# EAGLE design Haptic (EAGLE 9.6.2)
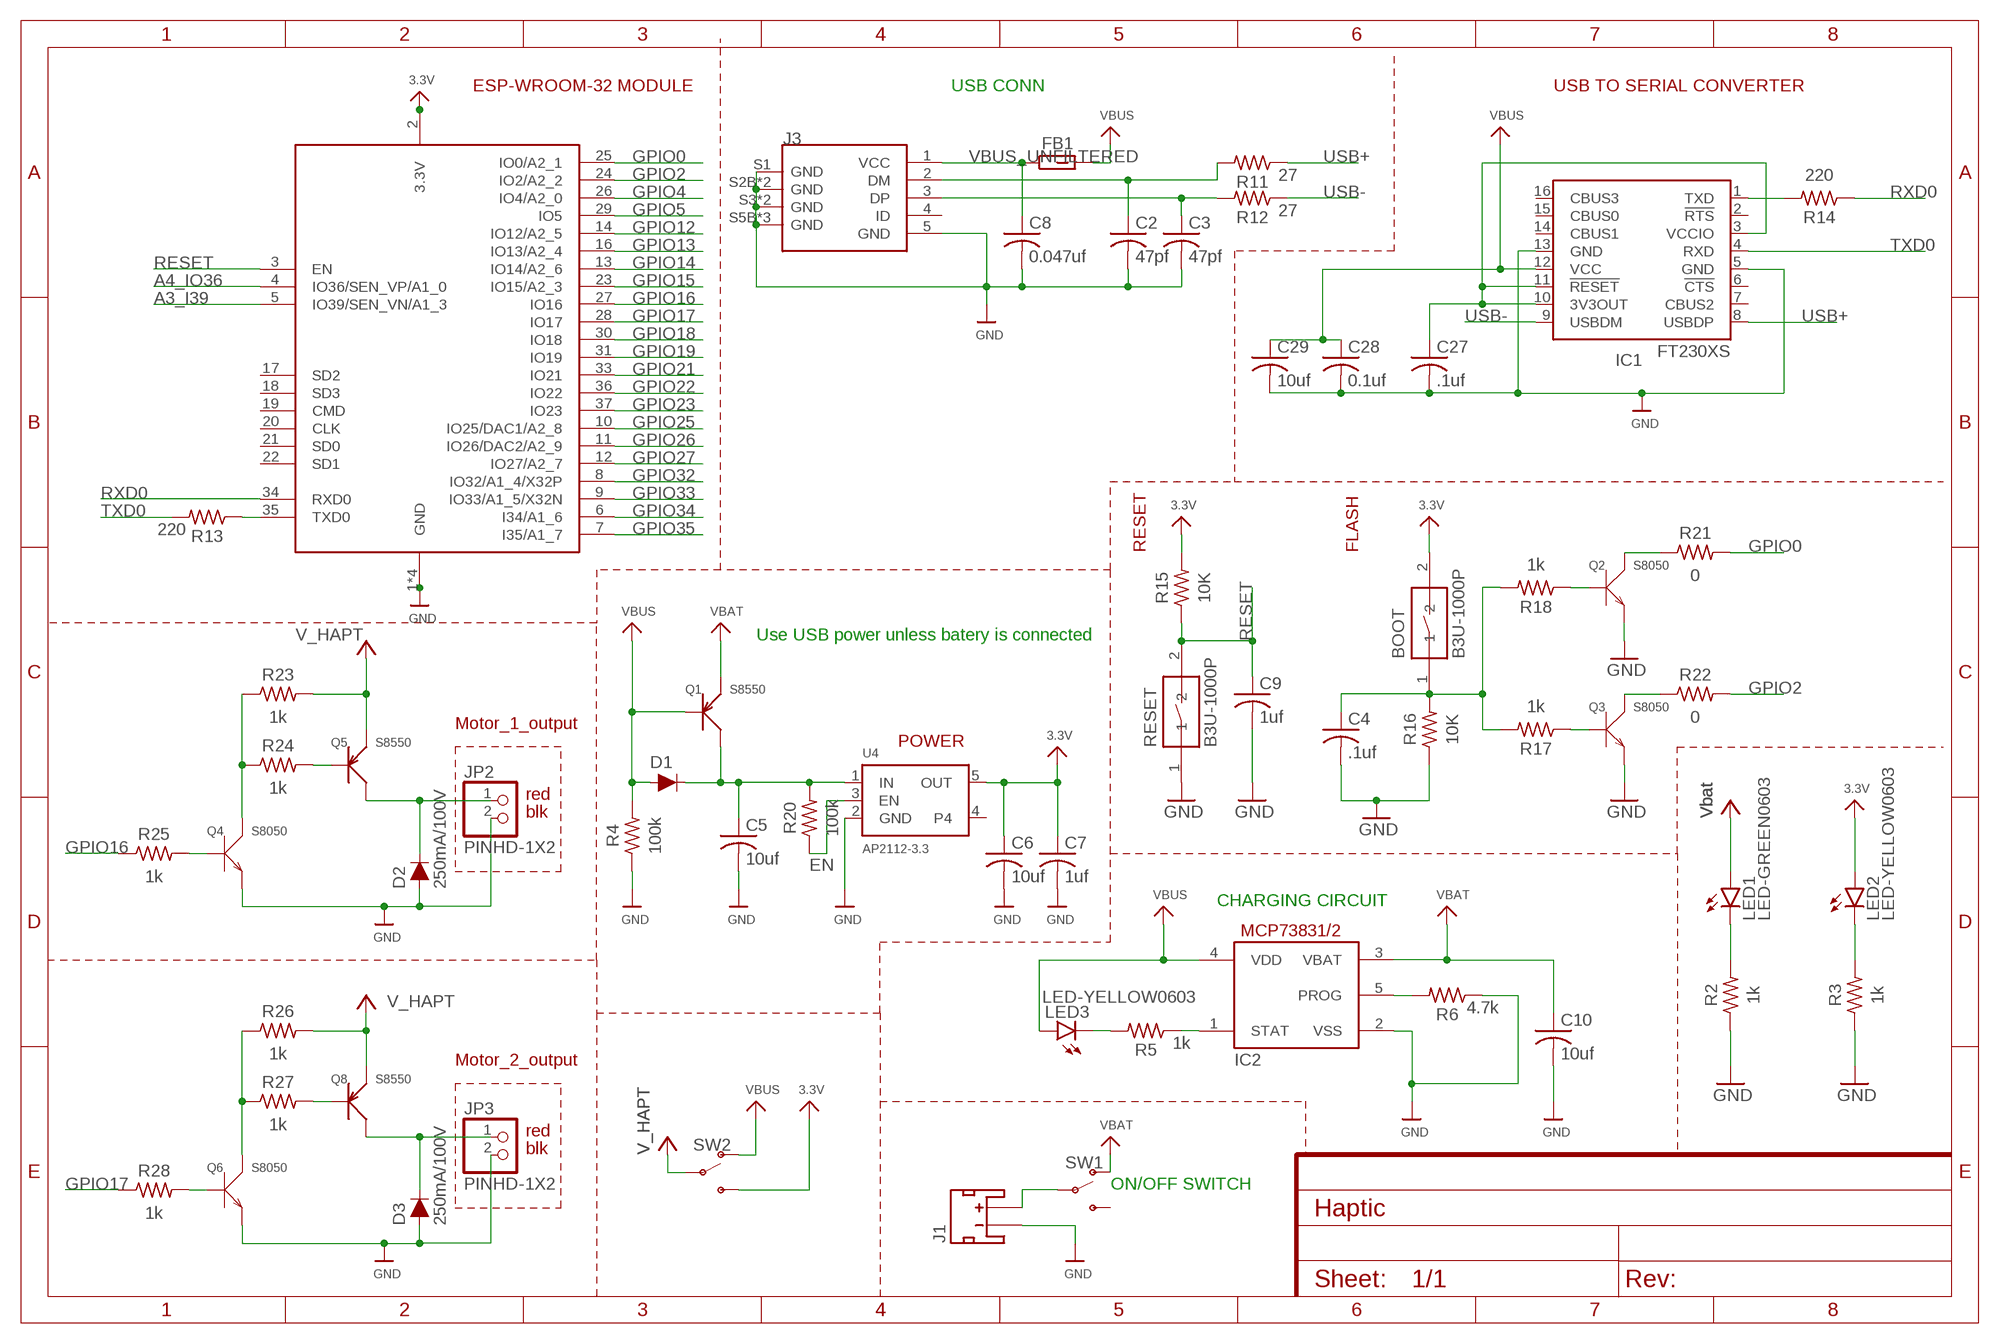
[diagram p0: schematic, sheet 1]

## Parts
BOOT  B3U-1000P  [B3U-1000P]
C2  47pf  C-US_CHIP-0603(1608-METRIC)  [CAPC1608X85]
C3  47pf  C-US_CHIP-0603(1608-METRIC)  [CAPC1608X85]
C4  .1uf  C-US_CHIP-0603(1608-METRIC)  [CAPC1608X85]
C5  10uf  C-US_CHIP-0603(1608-METRIC)  [CAPC1608X85]
C6  10uf  C-US_CHIP-0603(1608-METRIC)  [CAPC1608X85]
C7  1uf  C-US_CHIP-0603(1608-METRIC)  [CAPC1608X85]
C8  0.047uf  C-US_CHIP-0603(1608-METRIC)  [CAPC1608X85]
C9  1uf  C-US_CHIP-0603(1608-METRIC)  [CAPC1608X85]
C10  10uf  C-US_CHIP-0603(1608-METRIC)  [CAPC1608X85]
C27  .1uf  C-US_CHIP-0603(1608-METRIC)  [CAPC1608X85]
C28  0.1uf  C-US_CHIP-0603(1608-METRIC)  [CAPC1608X85]
C29  10uf  C-US_CHIP-0603(1608-METRIC)  [CAPC1608X85]
D1  250mA/100V  DIODE-BAS16J  [SOD-323]
D2  250mA/100V  DIODE-BAS16J  [SOD-323]
D3  250mA/100V  DIODE-BAS16J  [SOD-323]
FB1  BK1608TS601-T  FBCHIP-0603(1608-METRIC)  [BEADC1608X95N]
IC1  FT230XS  [SSOP16]
IC2  MCP73831/OT  [SOT23-5L]
J1  JST_2MM_MALE  [JST-2-SMD]
J3  10118193-0001LF  MICRO-USB-SMD-B-(10118193-0001LF)  [MICRO-USB5+6P-SMD-0.65-B]
JP2  PINHD-1X2  [1X02]
JP3  PINHD-1X2  [1X02]
LED1  LED-GREEN0603  [0603-GREEN]
LED2  LED-YELLOW0603  [0603-YELLOW]
LED3  LED-YELLOW0603  [0603-YELLOW]
Q1  S8550  SMD-TRANSISTORS-PNP-25V-500MA-S8550(SOT-23)  [SOT-23]
Q2  S8050  SMD-TRANSISTORS-NPN-25V-500MW-S8050(SOT-23)  [SOT-23]
Q3  S8050  SMD-TRANSISTORS-NPN-25V-500MW-S8050(SOT-23)  [SOT-23]
Q4  S8050  SMD-TRANSISTORS-NPN-25V-500MW-S8050(SOT-23)  [SOT-23]
Q5  S8550  SMD-TRANSISTORS-PNP-25V-500MA-S8550(SOT-23)  [SOT-23]
Q6  S8050  SMD-TRANSISTORS-NPN-25V-500MW-S8050(SOT-23)  [SOT-23]
Q8  S8550  SMD-TRANSISTORS-PNP-25V-500MA-S8550(SOT-23)  [SOT-23]
R2  1k  R-US_CHIP-0603(1608-METRIC)  [RESC1608X60]
R3  1k  R-US_CHIP-0603(1608-METRIC)  [RESC1608X60]
R4  100k  R-US_CHIP-0603(1608-METRIC)  [RESC1608X60]
R5  1k  R-US_CHIP-0603(1608-METRIC)  [RESC1608X60]
R6  4.7k  R-US_CHIP-0603(1608-METRIC)  [RESC1608X60]
R11  27  R-US_CHIP-0603(1608-METRIC)  [RESC1608X60]
R12  27  R-US_CHIP-0603(1608-METRIC)  [RESC1608X60]
R13  220  R-US_CHIP-0603(1608-METRIC)  [RESC1608X60]
R14  220  R-US_CHIP-0603(1608-METRIC)  [RESC1608X60]
R15  10K  R-US_CHIP-0603(1608-METRIC)  [RESC1608X60]
R16  10K  R-US_CHIP-0603(1608-METRIC)  [RESC1608X60]
R17  1k  R-US_CHIP-0603(1608-METRIC)  [RESC1608X60]
R18  1k  R-US_CHIP-0603(1608-METRIC)  [RESC1608X60]
R20  100k  R-US_CHIP-0603(1608-METRIC)  [RESC1608X60]
R21  0  R-US_CHIP-0603(1608-METRIC)  [RESC1608X60]
R22  0  R-US_CHIP-0603(1608-METRIC)  [RESC1608X60]
R23  1k  R-US_CHIP-0603(1608-METRIC)  [RESC1608X60]
R24  1k  R-US_CHIP-0603(1608-METRIC)  [RESC1608X60]
R25  1k  R-US_CHIP-0603(1608-METRIC)  [RESC1608X60]
R26  1k  R-US_CHIP-0603(1608-METRIC)  [RESC1608X60]
R27  1k  R-US_CHIP-0603(1608-METRIC)  [RESC1608X60]
R28  1k  R-US_CHIP-0603(1608-METRIC)  [RESC1608X60]
RESET  B3U-1000P  [B3U-1000P]
SW1  SWITCH-SPDT-SMD-RIGHT-ANGLE  [SWITCH_SPST_SMD_A]
SW2  SWITCH-SPDT-SMD-RIGHT-ANGLE  [SWITCH_SPST_SMD_A]
U4  AP2112-3.3  VREG_SOT23-5  [SOT23-5]
X6  ESP32_WROOM32_SKINNY  [WROOM32_SKINNY]

## Nets
3.3V: BOOT.2 C6.1 C7.1 LED2.A R15.2 SW2.3(S) U4.5(OUT) X6.2(3.3V)
A3_I39: X6.5(IO39/SEN_VN/A1_3)
A4_IO36: X6.4(IO36/SEN_VP/A1_0)
EN: R20.1 U4.3(EN)
GND: C2.2 C3.2 C4.2 C5.2 C6.2 C7.2 C8.2 C9.2 C10.2 C27.2 C28.2 C29.2 D2.A D3.A IC1.5(GND) IC1.13(GND) IC2.2(VSS) J1.1(-) J3.5(GND) J3.S1(GND) J3.S2B(GND) J3.S2T(GND) J3.S3(GND) J3.S4(GND) J3.S5B(GND) J3.S5T(GND) J3.S6(GND) JP2.2 JP3.2 Q2.2(E) Q3.2(E) Q4.2(E) Q6.2(E) R2.1 R3.1 R4.1 R6.1 R16.1 RESET.1 U4.2(GND) X6.1(GND) X6.15(GND) X6.38(GND) X6.P$1(GND)
GPIO0: R21.2 X6.25(IO0/A2_1)
GPIO2: R22.2 X6.24(IO2/A2_2)
GPIO4: X6.26(IO4/A2_0)
GPIO5: X6.29(IO5)
GPIO12: X6.14(IO12/A2_5)
GPIO13: X6.16(IO13/A2_4)
GPIO14: X6.13(IO14/A2_6)
GPIO15: X6.23(IO15/A2_3)
GPIO16: R25.1 X6.27(IO16)
GPIO17: R28.1 X6.28(IO17)
GPIO18: X6.30(IO18)
GPIO19: X6.31(IO19)
GPIO21: X6.33(IO21)
GPIO22: X6.36(IO22)
GPIO23: X6.37(IO23)
GPIO25: X6.10(IO25/DAC1/A2_8)
GPIO26: X6.11(IO26/DAC2/A2_9)
GPIO27: X6.12(IO27/A2_7)
GPIO32: X6.8(IO32/A1_4/X32P)
GPIO33: X6.9(IO33/A1_5/X32N)
GPIO34: X6.6(I34/A1_6)
GPIO35: X6.7(I35/A1_7)
N$1: LED2.C R3.2
N$2: LED1.C R2.2
N$3: C2.1 J3.2(DM) R11.2
N$4: C3.1 J3.3(DP) R12.2
N$5: C27.1 IC1.3(VCCIO) IC1.10(3V3OUT) IC1.11(!RESET)
N$6: R13.1 X6.35(TXD0)
N$7: IC1.1(TXD) R14.2
N$10: BOOT.1 C4.1 R16.2 R17.2 R18.2
N$11: Q2.1(B) R18.1
N$12: Q3.1(B) R17.1
N$13: Q3.3(C) R22.1
N$14: Q2.3(C) R21.1
N$15: Q4.1(B) R25.2
N$16: IC2.5(PROG) R6.2
N$17: IC2.1(STAT) R5.1
N$18: Q4.3(C) R23.1 R24.1
N$19: Q5.1(B) R24.2
N$20: Q6.1(B) R28.2
N$21: D2.C JP2.1 Q5.3(C)
N$22: LED3.C R5.2
N$23: J1.2(+) SW1.2(P)
N$24: Q6.3(C) R26.1 R27.1
N$25: Q8.1(B) R27.2
N$26: C5.1 D1.C Q1.3(C) R20.2 U4.1(IN)
N$27: D3.C JP3.1 Q8.3(C)
RESET: C9.1 R15.1 RESET.2 X6.3(EN)
RXD0: R14.1 X6.34(RXD0)
TXD0: IC1.4(RXD) R13.2
USB+: IC1.8(USBDP) R12.1
USB-: IC1.9(USBDM) R11.1
VBAT: C10.1 IC2.3(VBAT) Q1.2(E) SW1.1(O)
VBUS: C28.1 C29.1 D1.A FB1.2 IC1.12(VCC) IC2.4(VDD) LED3.A Q1.1(B) R4.2 SW2.1(O)
VBUS_UNFILTERED: C8.1 FB1.1 J3.1(VCC)
VCC: LED1.A Q5.2(E) Q8.2(E) R23.2 R26.2 SW2.2(P) ; supply symbol labelled V_HAPT, Vbat
Unconnected: IC1.2(!RTS) IC1.6(!CTS) IC1.7(CBUS2) IC1.14(CBUS1) IC1.15(CBUS0) IC1.16(CBUS3) J1.NC1(PAD1) J1.NC2(PAD2) J3.4(ID) SW1.3(S) U4.4 X6.17(SD2) X6.18(SD3) X6.19(CMD) X6.20(CLK) X6.21(SD0) X6.22(SD1)

## Notes on the sheet
- ESP-WROOM-32 MODULE | USB CONN | USB TO SERIAL CONVERTER
- RESET | FLASH
- Use USB power unless batery is connected
- Motor_1_output
- POWER
- red
- blk
- CHARGING CIRCUIT
- Motor_2_output
- red
- blk
- ON/OFF SWITCH

## Library data of the parts
BOOT RESET = Switch:B3U-1000P: SWITCH TACTILE SPST-NO 0.05A 12V Manufacturer's datasheet <https://omronfs.omron.com/en_US/ecb/products/pdf/en-b3u.pdf>; CREATED_BY: PCBLayout.com; DIGI_KEY_PART_NUMBER: SW1020CT-ND; MANUFACTURER: Omron Electronics Inc-EMC Div; MPN: B3U-1000P; PACKAGE: SPST-NO
C2-C10 C27-C29 = Capacitor:C-US: Capacitor - ANSI; CATEGORY: Capacitor
D1-D3 = SparkFun-DiscreteSemi:DIODE: Diode These are standard reverse protection diodes and small signal diodes. SparkFun Products: SparkFun SparkPunk Sound Kit <https://www.sparkfun.com/products/11177> SparkFun ESP8266 Thing <https://www.sparkfun.com/products/13231>; PROD_ID: DIO-09646
FB1 = Filter:FB: Ferrite Bead - Generic; CATEGORY: Filter; SUB-CATEGORY: Ferrite bead
IC1 = ftdichip:FT230X: USB to BASIC UART IC Auto generated by make-symbol-device-package-bsdl.ulp Rev. 43 Source: Data sheet <http://www.ftdichip.com/Support/Documents/DataSheets/ICs/DS_FT230X.pdf>
IC2 = adafruit:MCP73831: MCP73831/2 Miniature Single-Cell, Fully Integrated Li-Ion, Li-Polymer Charge Management Controllers. Nice and small simple lipoly charge controller, with adjustable current and status output (LED) http://www.ladyada.net/library/pcb/eaglelibrary.html
J1 = SparkFun-Connectors:JST_2MM_MALE: JST 2MM MALE RA CONNECTOR Two pin, compact surface mount connector. Commonly used as a battery input connection point. We really like the solid locking feeling and high current rating on these small connectors. We use these all the time as battery connectors. Mates to single-cell LiPo batteries. Here is the connector we sell at SparkFun: JST Right Angle Connector - White <https://www.sparkfun.com/products/8612> (PRT-08612) Datasheet <http://www.sparkfun.com/datasheets/Prototyping/Connectors/JST-Horizontal.pdf> It was used on these SparkFun products: SparkFun MOSFET Power Controller <https://www.sparkfun.com/products/11214> (PRT-11214) SparkFun Battery Babysitter - LiPo Battery Manager <https://www.sparkfun.com/products/13777> (PRT-13777) And many, many others that required a lipo battery connection.; PROD_ID: CONN-11443; SF_ID: PRT-08612
J3 = OPL_Connector:MICRO-USB-SMD-B-(10118193-0001LF): Seeed SKU 320010003 - SMD Micro USB-B MPN: 10118193-0001LF Important Notes: This part requires milling slots. Please make sure layer 46 Milling is included in the profile or outline layer when exporting Gerber files. Alternatively, you can use the built-in Seeed Fusion CAM file. Find it under Third-Party CAM files. This part has an overhanging portion. The edge of the PCB should be aligned with the line marked PCB Edge to be mounted correctly. Seeed Fusion PCBA OPL <https://www.seeedstudio.com/opl.html> Order PCB/PCBA Now <https://www.seeedstudio.com/fusion_pcb.html> www.seeedstudio.com; MPN: 10118193-0001LF
JP2 JP3 = Connector:PINHD-1X2: PIN HEADER; CATEGORY: CONNECTOR; SUB-CATEGORY: PIN-HEADER
LED1 = BeagleBone_Blue_R3:LED-GREEN
LED2 LED3 = BeagleBone_Blue_R3:LED-YELLOW
Q1 Q5 Q8 = OPL_Discrete_Semiconductor:SMD-TRANSISTORS-PNP-25V-500MA-S8550(SOT-23): 305020006; MPN: S8550
Q2-Q4 Q6 = OPL_Discrete_Semiconductor:SMD-TRANSISTORS-NPN-25V-500MW-S8050(SOT-23): 305010017; MPN: S8050
R2-R6 R11-R18 R20-R28 = Resistor:R-US: Resistor Fixed - ANSI; CATEGORY: Resistor; SUB-CATEGORY: Fixed
SW1 SW2 = SparkFun-Switches:SWITCH-SPDT: Single Pole, Double Throw (SPDT) Switch Single-pole, double-throw (SPDT) switch. Variant Overview SMD-AYZ0202 Surface Mount DPDT Switch <https://www.sparkfun.com/products/597> (COM-00597) Used on e.g. LilyPad Arduino USB - ATmega32U4 Board <https://www.sparkfun.com/products/12049> PTH-11.6X4.0MM SPDT Mini Power Switch <https://www.sparkfun.com/products/102> (COM-00102) Used on e.g. SparkFun Simon Says - Through-Hole Soldering Kit <https://www.sparkfun.com/products/10547> (KIT-10547) PTH-11.6X4.0MM-KIT KIT version of SPDT Mini Power Switch - Simplifies soldering by removing tStop of switch pins - only one side can be soldered. PTH-11.6X4.0MM-LOCK LOCK version of SPDT Mini Power Switch - Offset pins hold switch in place for easier soldering. SMD-RIGHT-ANGLE Surface Mount Right Angle Switch <https://www.sparkfun.com/products/10860> (COM-10860) Used on e.g. SparkFun ESP8266 Thing <https://www.sparkfun.com/products/13231>; PROD_ID: SWCH-10651; SF_SKU: COM-10860
U4 = microbuilder:VREG_SOT23-5: SOT23-5 Fixed Voltage Regulators Part Current Out V Out V In V Dropout θJA (°C/W) TJ (°C) Digikey Part No. ADP121 150mA 3.3V 3.4-5.5V 0.09V @ 150mA -- -- ADP121-AUJZ33R7CT-ND ADP121 150mA 3.0V 3.1-5.5V 0.09V @ 150mA -- -- ADP121-AUJZ30R7CT-ND ADP122 300mA 3.3V 3.4-5.5V 0.085V @ 300mA -- -- ADP122AUJZ-3.3-R7CT-ND ADP1712 300mA 3.3V 3.5-5.5V 0.17V @ 300mA -- -- ADP1712AUJZ-3.3-R7TR-ND AP7311 (Low Cost) 150mA 3.3V 3.5-6V 0.15V @ 150mA -- -- AP7311-33WG-7DICT-ND LD39015M18R 150mA 1.8V 1.9V-5.5V 0.08V @ 100mA -- -- 497-6977-1-ND LP2985A-33DBVR 150mA 3.3V 3.3-16V 0.28V @ 150mA 206 150 296-18479-1-ND MCP1824T-3302E/OT 300mA 3.3V 3.5V-6V 0.2V @ 300mA -- -- MCP1824T-3302E/OTCT-ND MIC5205-2.5YM5 TR 150mA 2.5V 2.7-16V 0.165V @ 150mA -- -- 576-1257-2-ND MIC5205-3.0YM5 TR 150mA 3.0V 3.2V-16V 0.165V @ 150mA -- -- 576-1258-2-ND MIC5205-3.3YM5 TR 150mA 3.3V 3.5V-16V 0.165V @ 150mA -- -- 576-1259-2-ND TPS780330220 150mA 3.3V+2.2V 3.6-5.5V 250mV Max -- -- 296-23332-1-ND TDA3663/N1,135 100mA 3.3V 3.5-45V 0.18V @ 50mA -- -- 568-5343-1-ND Max operating temp can be calculated using θJA, TJ (max junction temperature), and power in watts. Set the "Maximum Ambient Temperature" until it reaches TJ ("Max Junction Temperature"), which is the absolute limit for safe use of the regulator: Heat Sink Temperature Calculator <http://www.daycounter.com/Calculators/Heat-Sink-Temperature-Calculator.phtml> For example, With 12V source into a 3.3V LP2985 and a 30mA load, we are dissipating (12V-3.3V) * 0.03A = 0.261W. With a θJA of 206 °C/W, a TJ of 150°C, and 261mW we can safely use the chip without a heat sink up to 75°C (=147.1°C Junction Temperature).
X6 = microbuilder:ESP32_WROOM32

## Board
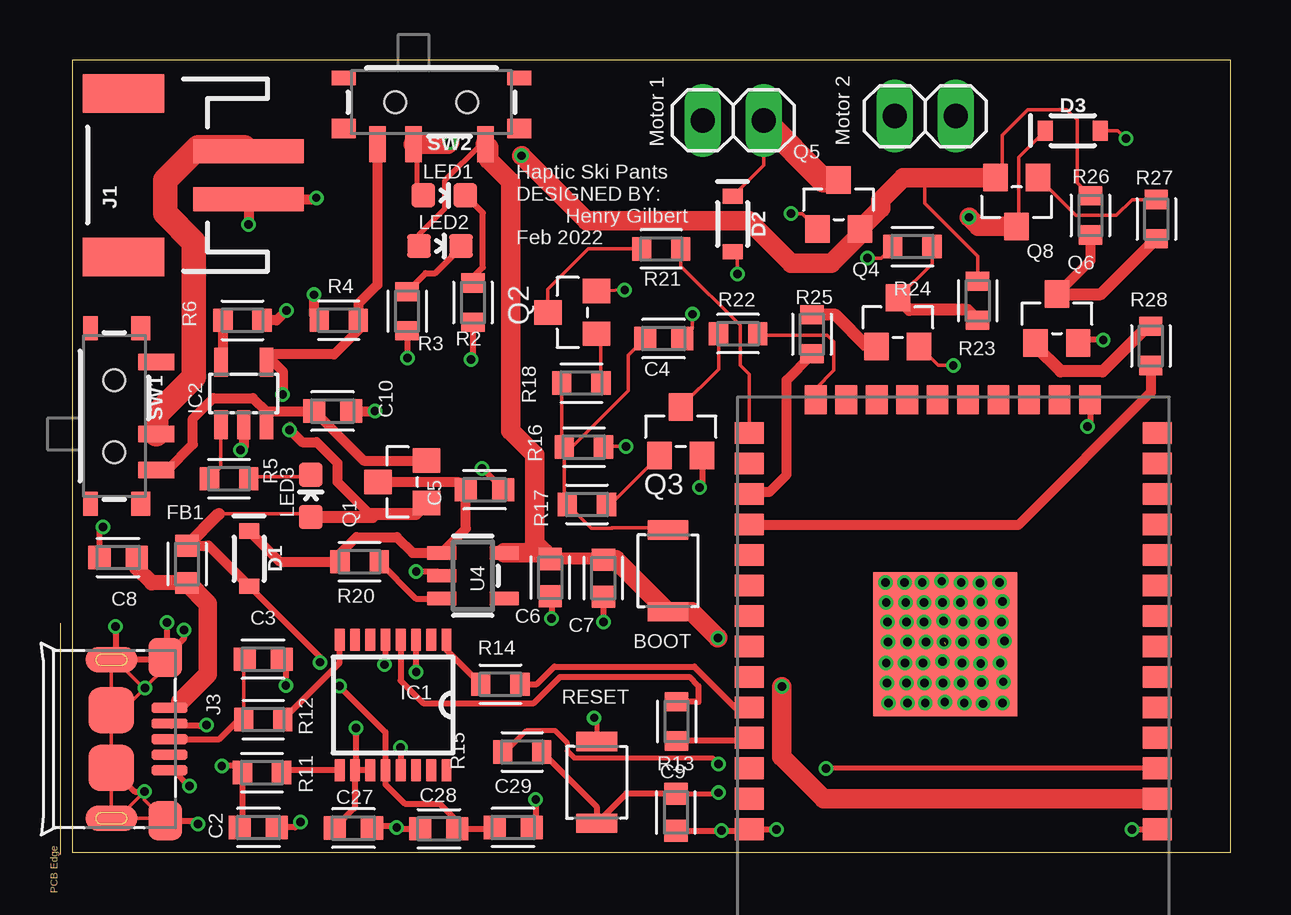
[diagram p1: board, top side]
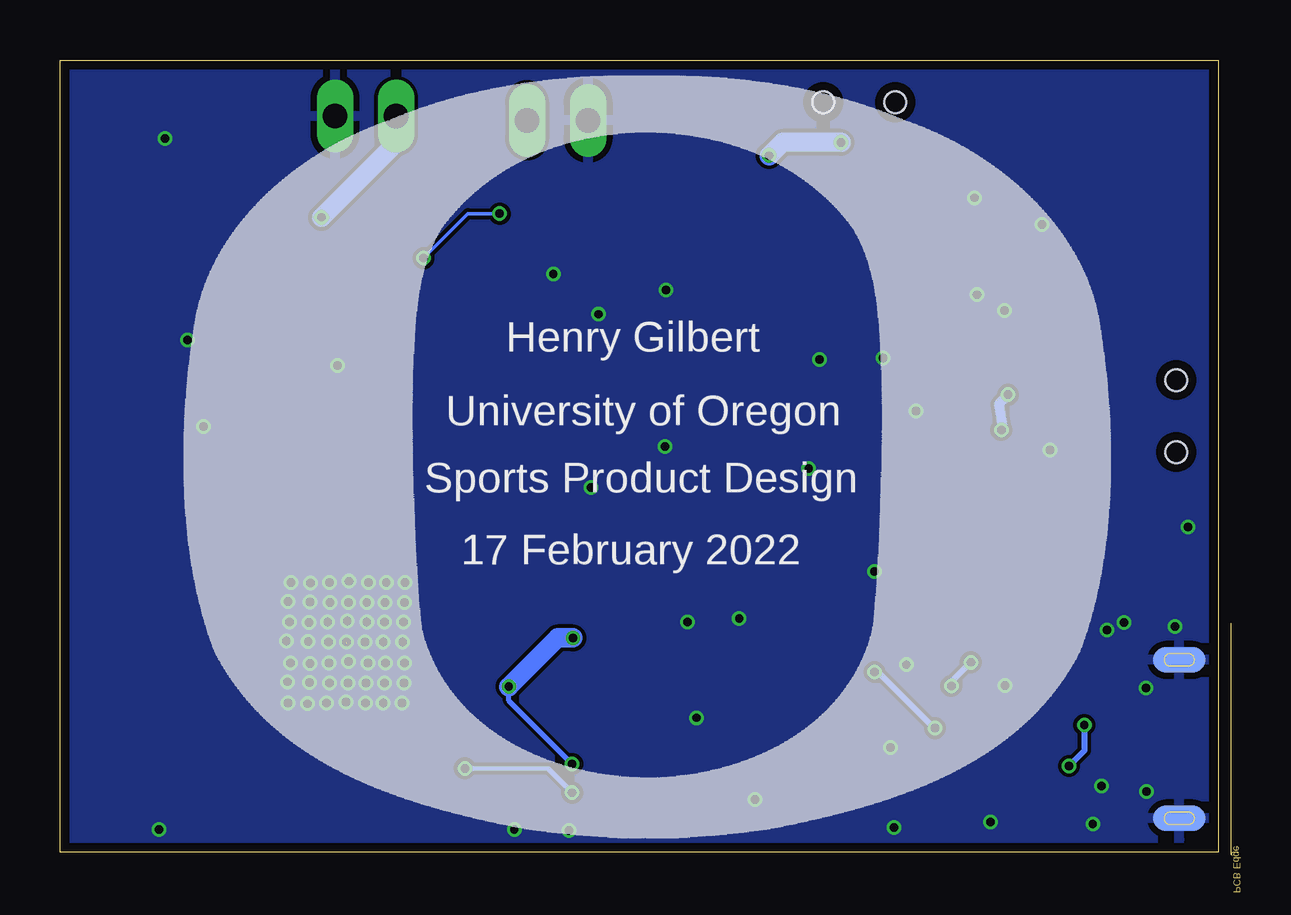
[diagram p2: board, bottom side, seen from below]

Size 48.27 x 33.02 mm. Coordinates in mm from the lower left corner, seen from the top.
Outline: 0,0 48.27,0 48.27,33.02 0,33.02 0,0
Copper layers (1*16): Top 0.035559375mm / dielectric 1.6mm / Bottom 0.035559375mm
Design rules "oshpark-2layer": minimum track width 6mil, minimum drill 10mil, track to track 6mil, track to pad 6mil, pad to pad 6mil, via to via 6mil, smd to smd 6mil, copper to edge 15mil, drill to drill 6mil, minimum pad ring 5mil, minimum via ring 5mil, stop-mask expansion 2.5mil, vias tented up to drill 0mil, thermal gap 10mil

### Footprints (pad centres in the part's own frame; a part is rotated, then mirrored left to right if it is on the bottom)
B3U-1000P = smd 0.8 x 1.7: 1 -1.7,0; 2 1.7,0
CAPC1608X85 = smd 0.921 x 0.97: 1 -0.775,0; 2 0.775,0
SOD-323 = smd 0.63 x 0.83: A 1.15,0; C -1.15,0
BEADC1608X95N = smd 0.9 x 0.97: 1 -0.785,0 | smd 0.933 x 0.97: 2 0.769,0
SSOP16 = smd 0.914 x 0.406: 1 -2.718,2.223; 2 -2.718,1.587; 3 -2.718,0.953; 4 -2.718,0.318; 5 -2.718,-0.318; 6 -2.718,-0.953; 7 -2.718,-1.587; 8 -2.718,-2.223; 9 2.718,-2.223; 10 2.718,-1.587; 11 2.718,-0.953; 12 2.718,-0.318; 13 2.718,0.318; 14 2.718,0.953; 15 2.718,1.587; 16 2.718,2.223
SOT23-5L = smd 0.55 x 1.2: 1 -0.95,-1.3; 2 0,-1.3; 3 0.95,-1.3; 4 0.95,1.3; 5 -0.95,1.3
JST-2-SMD = smd 1 x 4.6: 1 -1,-3.7; 2 1,-3.7 | smd 1.6 x 3.4: NC1 -3.4,1.5; NC2 3.4,1.5
MICRO-USB5+6P-SMD-0.65-B = smd 0.4 x 1.5: 1 -1.3,-0.25; 2 -0.65,-0.25; 3 0,-0.25; 4 0.65,-0.25; 5 1.3,-0.25 | smd 1.6 x 1.4: S1 -3.4,-0.427; S6 3.4,-0.427 | smd 1.067 x 2.184 bottom: S2B -3.302,-2.667; S5B 3.302,-2.667 | smd 1.067 x 2.184: S2T -3.302,-2.667; S5T 3.302,-2.667 | smd 1.9 x 1.9: S3 -1.2,-2.675; S4 1.2,-2.675
1X02 = drill 1.016 long: 1 -1.27,0; 2 1.27,0
0603-GREEN = smd 1 x 1: A 0,-0.877; C 0,0.877
0603-YELLOW = smd 1 x 1: A 0,-0.877; C 0,0.877
SOT-23 = smd 1.016 x 1.143: 1 -0.889,-1.016; 2 0.889,-1.016; 3 0,1.016
RESC1608X60 = smd 0.799 x 0.974: 1 -0.815,0; 2 0.815,0
SWITCH_SPST_SMD_A = smd 0.7 x 1.5: 1 -2.25,-1.75; 2 -0.75,-1.75; 3 2.25,-1.75 | smd 1 x 0.6: GND1 -3.65,1; GND3 3.65,1 | smd 1 x 0.8: GND2 -3.65,-1.1; GND4 3.65,-1.1 | hole 0.9: -1.5,0; 1.5,0
SOT23-5 = smd 0.55 x 1.2: 1 -0.95,-1.3; 2 0,-1.3; 3 0.95,-1.3; 4 0.95,1.3; 5 -0.95,1.3
WROOM32_SKINNY = smd 1.2 x 0.9: 1 -8.5,5; 2 -8.5,3.73; 3 -8.5,2.46; 4 -8.5,1.19; 5 -8.5,-0.08; 6 -8.5,-1.35; 7 -8.5,-2.62; 8 -8.5,-3.89; 9 -8.5,-5.16; 10 -8.5,-6.43; 11 -8.5,-7.7; 12 -8.5,-8.97; 13 -8.5,-10.24; 14 -8.5,-11.51; 25 8.5,-11.51; 26 8.5,-10.24; 27 8.5,-8.97; 28 8.5,-7.7; 29 8.5,-6.43; 30 8.5,-5.16; 31 8.5,-3.89; 32 8.5,-2.62; 33 8.5,-1.35; 34 8.5,-0.08; 35 8.5,1.19; 36 8.5,2.46; 37 8.5,3.73; 38 8.5,5 | smd 0.9 x 1.2: 15 -5.7,-12.9; 16 -4.43,-12.9; 17 -3.16,-12.9; 18 -1.89,-12.9; 19 -0.62,-12.9; 20 0.65,-12.9; 21 1.92,-12.9; 22 3.19,-12.9; 23 4.46,-12.9; 24 5.73,-12.9 | smd 6 x 6: P$1 0.34,-2.7

### Placement (x,y rotation side)
BOOT  24.82,11.73 270 top
C2  7.75,1.04 0 top
C3  7.95,8.05 0 top
C4  24.64,21.41 0 top
C5  17.17,15.11 0 top
C6  19.91,11.46 270 top
C7  22.12,11.43 270 top
C8  1.91,12.29 180 top
C9  25.15,1.68 270 top
C10  10.85,18.39 0 top
C27  11.71,1.02 0 top
C28  15.27,0.99 180 top
C29  18.36,1.04 0 top
D1  7.37,12.24 270 top
D2  27.51,26.19 270 top
D3  41.68,30.07 0 top
FB1  4.78,12.01 90 top
IC1  13.36,6.15 270 top
IC2  7.14,19.13 0 top
J1  3.63,28.22 90 top
J3  4.29,4.72 270 top
JP2  27.53,30.51 180 top
JP3  35.53,30.68 0 top
LED1  15.49,27.38 270 top
LED2  15.32,25.27 270 top
LED3  9.93,14.86 0 top
Q1  13.74,15.44 90 top
Q2  20.83,22.5 90 top
Q3  25.35,17.55 0 top
Q4  34.39,22.1 0 top
Q5  31.93,27 0 top
Q6  41.02,22.25 0 top
Q8  39.34,27.1 180 top
R2  16.69,22.91 90 top
R3  13.94,22.56 90 top
R4  11.1,22.17 0 top
R5  6.53,15.57 0 top
R6  7.09,22.17 180 top
R11  7.9,3.33 180 top
R12  7.95,5.54 180 top
R13  25.17,5.46 90 top
R14  17.83,7.01 180 top
R15  18.75,4.19 180 top
R16  21.31,16.89 180 top
R17  21.44,14.5 180 top
R18  21.21,19.56 180 top
R20  11.96,12.12 180 top
R21  24.54,25.15 0 top
R22  27.74,21.62 0 top
R23  37.72,22.99 90 top
R24  35,25.25 180 top
R25  30.81,21.59 90 top
R26  42.42,26.54 90 top
R27  45.16,26.39 90 top
R28  44.93,21.11 90 top
RESET  21.84,2.92 270 top
SW1  1.75,18.19 90 top
SW2  14.96,31.27 0 top
U4  16.69,11.53 270 top
X6  36.7,5.97 180 top

### Tracks (layer width: path | path; a pad name or v marks a point on that pad's centre or on a via)
3.3V  (via drill 0.35)
  Top 0.2: R15.2 18.05,4.19 18.94,5.08 20.11,5.08 20.61,4.57 20.61,4.23 20.9,3.94 26.66,3.94 v26.92,3.68 | SW2.3 17.03,29.52 15.5,27.98 15.5,26.8 14.44,25.74 LED2.A
  Top 0.508: C6.1 22.1,12.23 C7.1
  Top 0.813: C7.1 22.65,12.21 BOOT.2 25.8,10.04 v26.9,8.94 | v29.57,6.91 29.57,3.99 31.31,2.24 X6.2 | U4.5 19.66,12.48 | 19.66,12.48 C6.1 | SW2.3 17.34,29.39 17.34,28.87 18.27,27.94 18.27,17.58 19.27,16.58 19.27,12.88 19.66,12.48
  Bottom 0.2: v26.92,3.68 29.57,6.33 v29.57,6.91
  Bottom 0.813: v26.9,8.94 27.53,8.94 v29.57,6.91
EN
  Top 0.254: R20.1 14.31,10.58 U4.3
GND  (via drill 0.35)  (1 unrouted)
  Top 0.152: v23.06,16.92 22.15,16.92 R16.1 | v23.01,23.44 Q2.2 | D2.A 27.71,24.83 v27.71,24.11 | v36.7,20.3 36.07,20.3 Q4.2 | v25.83,22.43 25.83,21.83 C4.2 | D3.A 43.56,30.07 v43.89,29.74 | 1.88,1.42 3.77,1.42 J3.S6 3,2.19 v3,2.54 1.88,1.42 | 1.7,3.45 1.63,3.38 J3.S5T 1.85,1.42 1.88,1.42 | J3.S4 J3.S3 1.62,6.25 | 1.62,6.25 1.62,8.02 J3.S2T 1.78,8.03 2.98,6.82 | 2.98,6.82 v3.02,6.86 3.87,7.7 J3.S1 | 2.98,6.82 2.41,6.25 1.62,6.25
  Top 0.2: v21.74,5.61 21.84,5.51 RESET.1
  Top 0.254: v13.66,4.37 13.68,4.36 IC1.13 | C27.2 12.56,1.09 13.46,1.09 v13.51,1.04 13.56,0.99 C28.2 | v19.3,2.21 19.3,1.21 C29.2 | IC1.5 13.04,7.86 v13.01,7.82 | v9.5,1.27 9.27,1.04 C2.2 | J3.S6 5.1,1.32 v5.23,1.19 | J3.5 4.22,3.42 v4.88,2.77 | J3.S4 1.7,3.45 2.6,2.54 v3,2.54 | v4.65,9.27 4.65,8.91 J3.S1 | v3.94,9.58 3.94,8.2 J3.S1 | v1.8,9.42 1.8,8.2 J3.S2T 3.77,8.03 J3.S1 | C8.2 1.13,13.42 v1.27,13.56 | C3.2 8.89,7.89 v8.89,6.96 | C9.2 25.16,0.91 v27.05,0.91 28.15,0.91 X6.38 v29.33,0.97 v29.34,0.96 | v44.15,0.96 v44.15,0.97 X6.1 | v42.95,21.36 42.04,21.36 Q6.2 | X6.15 42.4,17.87 v42.29,17.75 | Q3.2 26.24,15.32 v26.14,15.21 | C7.2 v22.12,9.6 | C6.2 19.96,10.63 v19.96,9.75 | v14.33,11.71 15.21,11.71 U4.2 | C5.2 17.95,15.13 v17.07,16 | R3.1 13.95,20.62 v13.97,20.6 | R2.1 16.69,20.62 v16.61,20.55
  Top 0.406: IC2.2 7.14,16.89 v7.01,16.76 | v8.91,22.58 8.51,22.17 R6.1 | v10.06,23.24 10.06,22.4 R4.1 | C10.2 v12.6,18.39 | v10.16,27.28 10.1,27.22 J1.1 v7.34,26.16
  other vias: 33.88,11.25 34.67,11.25 35.41,11.25 36.22,11.3 37.03,11.25 37.82,11.23 33.91,10.41 34.72,10.41 35.48,10.41 36.25,10.41 37.01,10.41 37.85,10.44 38.76,10.46 38.63,11.25 33.96,9.6 34.75,9.6 35.48,9.6 36.3,9.65 37.11,9.6 37.9,9.58 33.99,8.76 34.8,8.76 35.56,8.76 36.32,8.76 37.08,8.76 37.92,8.79 38.84,8.81 38.71,9.6 34.01,6.22 34.8,6.22 35.53,6.22 36.35,6.27 37.16,6.22 37.95,6.2 38.76,6.22 33.91,7.9 34.7,7.9 35.43,7.9 36.25,7.95 37.06,7.9 37.85,7.87 33.93,7.06 34.75,7.06 35.51,7.06 36.27,7.06 37.03,7.06 37.87,7.09 38.79,7.11 38.66,7.9
  pour Bottom: -14.53,-14.43 78.99,-14.43 74.12,42.65 -9.75,42.65
GPIO0
  Top 0.152: X6.25 28.2,19.93 27.82,20.31 27.82,21.96 25.35,24.43 R21.2
GPIO2
  Top 0.152: X6.24 30.97,19.33 31.73,20.09 31.73,21.28 31.46,21.55 28.61,21.55 R22.2
GPIO16
  Top 0.406: X6.27 28.3,15.04 29.06,15.04 29.76,15.74 29.76,19.68 30.81,20.73 R25.1
GPIO17
  Top 0.406: R28.1 44.93,19.18 39.4,13.64 28.23,13.64 X6.28
N$1
  Top 0.254: R3.2 14.71,24.14 15.11,24.14 16.19,25.22 LED2.C
N$2
  Top 0.254: R2.2 16.69,23.96 17.1,24.38 17.1,26.65 LED1.C
N$3  (via drill 0.35)
  Top 0.254: v6.22,3.61 6.8,3.61 R11.2 7.08,1.15 C2.1 | v5.59,5.31 5.33,5.31 5.3,5.28 4.14,5.28 J3.2
  Bottom 0.254: v5.59,5.31 5.59,4.24 v6.22,3.61
N$4
  Top 0.152: R12.2 7.13,8.01 C3.1
  Top 0.254: R12.2 6.92,5.54 6.11,4.72 J3.3
N$5  (via drill 0.35)
  Top 0.254: IC1.10 11.77,1.85 C27.1 | IC1.11 IC1.10 | IC1.3 14.31,7.53 v14.33,7.52 | v11.81,5.18 11.81,3.47 IC1.10
  Bottom 0.254: v14.33,7.52 14.17,7.52 11.84,5.18 v11.81,5.18
N$6
  Top 0.254: X6.35 28.07,4.65 R13.1
N$7
  Top 0.254: R14.2 15.58,8.44 IC1.1
N$10
  Top 0.152: R18.2 20.39,16.99 R16.2 20.5,16.58 | 20.5,16.58 20.5,14.63 R17.2 21.61,13.51 22.5,13.51 22.48,13.53 24.72,13.53 BOOT.1 | C4.1 23.16,20.71 23.16,19.24 20.5,16.58
N$11
  Top 0.152: Q2.1 22.02,21.43 R18.1
N$12
  Top 0.152: Q3.1 22.43,14.5 R17.1
N$13
  Top 0.152: R22.1 26.92,20.14 Q3.3
N$14
  Top 0.152: Q2.3 19.81,23.47 21.49,25.15 R21.1
N$15
  Top 0.508: Q4.1 33.12,21.08 31.8,22.41 R25.2
N$16
  Top 0.406: R6.2 6.27,20.51 IC2.5
N$17
  Top 0.152: IC2.1 6.19,16.05 R5.1
N$18
  Top 0.152: Q4.3 35.82,24.54 R24.1
  Top 0.508: Q4.3 34.39,23.09 34.87,22.6 37.29,22.6 R23.1
N$19  (via drill 0.35)
  Top 0.152: R24.2 33.7,24.77 v33.12,24.77 | v29.95,26.62 30.4,26.62 Q5.1
  Bottom 0.152: v33.12,24.77 31.27,26.62 v29.95,26.62
N$20
  Top 0.508: R28.2 44.81,21.92 42.93,20.04 41.17,20.04 40.13,21.08 Q6.1
N$21
  Top 0.152: JP2.1 28.8,28.63 D2.C
  Top 1.016: JP2.1 31.29,28.02 Q5.3
N$22
  Top 0.152: R5.2 7.42,15.65 9.84,15.65 LED3.C
N$23
  Top 1.016: SW1.2 3.5,18.23 5.07,19.8 5.07,25.44 3.86,26.64 3.86,28.01 5.24,29.39 7.17,29.39 J1.2
N$24
  Top 0.406: Q6.3 42.42,24.66 R26.1
  Top 0.508: R27.1 42.85,23.27 Q6.3
N$25
  Top 0.152: R27.2 44.15,27.21 43.5,26.55 41.8,26.55 Q8.1
N$26
  Top 0.406: D1.C 8.64,12.12 R20.2 11.15,12.45 11.84,13.14 13.52,13.14 14.17,12.48 U4.1 16.4,13.49 C5.1 16.07,15.44 Q1.3
N$27  (via drill 0.35)
  Top 0.152: D3.C 39.42,28.96 39.42,26.16 Q8.3
  Top 0.813: Q8.3 37.74,26.09 v37.36,26.47
  Bottom 0.813: v37.36,26.47 34.27,29.57 JP3.1
RESET  (via drill 0.35)
  Top 0.2: X6.3 v31.4,3.51 v31.39,3.5 | C9.1 26.89,2.45 v26.92,2.49
  Top 0.254: R15.1 21.84,1.91 RESET.2 23.07,2.45 C9.1
  Bottom 0.2: v31.39,3.5 27.94,3.5 v26.92,2.49
RXD0
  Top 0.254: R14.1 19.35,7.01 20.09,7.74 25.91,7.74 27.61,6.05 X6.34
TXD0
  Top 0.254: IC1.4 13.68,7.16 14.61,6.22 19.23,6.22 20.32,7.31 25.71,7.31 26.09,6.94 26.09,6.28 R13.2
USB+
  Top 0.254: R12.1 11.14,7.91 IC1.8
USB-
  Top 0.254: R11.1 8.82,3.43 IC1.9
VBAT
  Top 0.406: Q1.2 12.13,16.33 C10.1 8.07,18.39 | SW1.1 3.95,15.94 5.02,17.01 5.02,18.08 5.88,18.93 7.52,18.93 8.07,18.39 | IC2.3 8.09,18.37 8.07,18.39
VBUS  (via drill 0.35)
  Top 0.152: LED3.A 9.8,14.11 6.1,14.11
  Top 0.254: D1.A 10.31,8.15 v10.31,7.92 | v11.12,6.93 13.04,5.02 IC1.12 13.04,2.84 13.85,2.03 15.31,2.03 16.04,1.3 C28.1 17.54,0.99 C29.1
  Top 0.406: FB1.2 5.68,12.78 D1.A | SW2.1 12.71,23.66 11.91,22.86 R4.2 11.91,21.77 10.9,20.76 8.42,20.76 IC2.4 8.39,20.43 8.76,20.05 v8.76,19.07 | v9.04,17.6 9.07,17.73 9.07,17.6 9.57,17.1 10.18,17.1 11.04,16.23 11.04,15.44 12.37,14.11 12.5,13.98
  Top 0.508: FB1.2 6.1,14.11 | LED3.A 12.5,13.98 | 12.37,14.11 14.31,14.11 Q1.1
  Bottom 0.254: v10.31,7.92 11.12,7.11 v11.12,6.93
  Bottom 0.406: v8.76,19.07 9.14,18.69 8.99,17.65 v9.04,17.6
VBUS_UNFILTERED
  Top 0.254: J3.1 4.3,6.29 4.5,6.29
  Top 0.635: FB1.1 3.3,11.23 2.68,11.85 C8.1
  Top 0.762: FB1.1 5.63,10.37 5.63,7.42 4.5,6.29
VCC  (via drill 0.35)
  Top 0.152: Q8.2 38.73,28.4 38.73,29.88 39.8,30.95 41.44,30.95 41.86,30.52 41.86,27.91 R26.2 | R23.2 37.72,24.84 35.51,27.05 35.51,28.12
  Top 0.2: SW2.2 14.34,29.39 14.34,27.66 LED1.A
  Top 0.813: SW2.2 15.65,29.52 v15.72,29.59 | v18.72,29.03 21.43,26.32 28.18,26.32 29.95,24.55 31.61,24.55 32.82,25.75 Q5.2 33.69,26.85 33.69,27.18 34.63,28.12 35.51,28.12 Q8.2
  Bottom 0.813: v15.72,29.59 18.16,29.59 v18.72,29.03

### Text on the board
tNames: Motor 1 | Motor 2 | Haptic Ski Pants / DESIGNED BY: / Henry Gilbert / Feb 2022
bNames: Henry Gilbert | University of Oregon | Sports Product Design | 17 February 2022